# EAGLE design v1 (EAGLE 6.6.0)
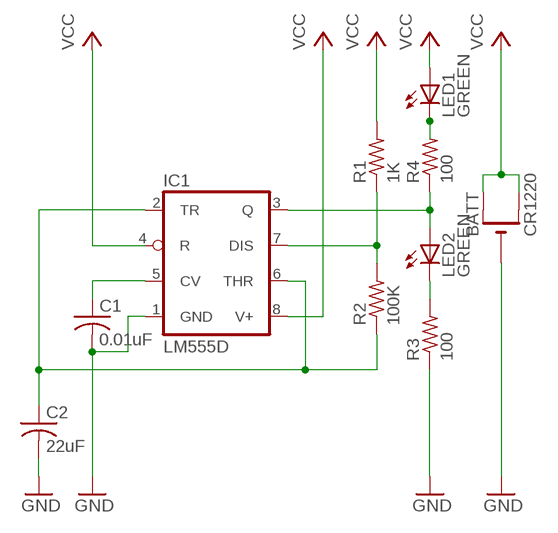
[diagram p0: schematic, sheet 1]

## Parts
BATT  CR1220  CR1220SMT  [CR1220-SMD]
C1  0.01uF  C-USC0805  [C0805]
C2  22uF  C-USC0805  [C0805]
IC1  LM555D  [SO08]
LED1  GREEN  LEDCHIP-LED0805  [CHIP-LED0805]
LED2  GREEN  LEDCHIP-LED0805  [CHIP-LED0805]
R1  1K  R-US_R0805  [R0805]
R2  100K  R-US_R0805  [R0805]
R3  100  R-US_R0805  [R0805]
R4  100  R-US_R0805  [R0805]

## Nets
GND: BATT.- C1.2 C2.2 IC1.1(GND) R3.1
N$1: LED1.C R4.2
N$2: IC1.3(Q) LED2.A R4.1
N$3: LED2.C R3.2
N$5: IC1.7(DIS) R1.1 R2.2
N$6: C2.1 IC1.2(TR) IC1.6(THR) R2.1
N$7: C1.1 IC1.5(CV)
VCC: BATT.+$1(+) BATT.+$2(+1) IC1.4(R) IC1.8(V+) LED1.A R1.2

## Library data of the parts
BATT = adafruit:CR1220: CR1216/CR1220/CR1225 12mm 3V lithium coin cell Great for battery packup. Both SMT and THM holders. Note the THM package has the ground pads on both sides of the PCB so that the masks are the same - this reduces the cost; OC_NEWARK: unknown
C1 = adafruit:C-US: CAPACITOR, American symbol; MF: AVX CORPORATION; MPN: 08051C103KAT2A; OC_NEWARK: 01H7150
C2 = adafruit:C-US: CAPACITOR, American symbol; MPN: C2012X5R1A226K125AB; OC_NEWARK: 04X3270
IC1 = adafruit:*555: TIMER Changed DIP package to have round (not oval) pin pads http://www.ladyada.net/library/pcb/eaglelibrary.html; MF: FAIRCHILD SEMICONDUCTOR; MPN: LM555CM; OC_NEWARK: 78K6011
LED1 LED2 = adafruit:LED: LED OSRAM: - CHIPLED LG R971, LG N971, LY N971, LG Q971, LY Q971, LO R971, LY R971 LH N974, LH R974 LS Q976, LO Q976, LY Q976 LO Q996 - Hyper CHIPLED LW Q18S LB Q993, LB Q99A, LB R99A - SideLED LS A670, LO A670, LY A670, LG A670, LP A670 LB A673, LV A673, LT A673, LW A673 LH A674 LY A675 LS A676, LA A676, LO A676, LY A676, LW A676 LS A679, LY A679, LG A679 - Hyper Micro SIDELED® LS Y876, LA Y876, LO Y876, LY Y876 LT Y87S - SmartLED LW L88C, LW L88S LB L89C, LB L89S, LG L890 LS L89K, LO L89K, LY L89K LS L896, LA L896, LO L896, LY L896 - TOPLED LS T670, LO T670, LY T670, LG T670, LP T670 LSG T670, LSP T670, LSY T670, LOP T670, LYG T670 LG T671, LOG T671, LSG T671 LB T673, LV T673, LT T673, LW T673 LH T674 LS T676, LA T676, LO T676, LY T676, LB T676, LH T676, LSB T676, LW T676 LB T67C, LV T67C, LT T67C, LS T67K, LO T67K, LY T67K, LW E67C LS E67B, LA E67B, LO E67B, LY E67B, LB E67C, LV E67C, LT E67C LW T67C LS T679, LY T679, LG T679 LS T770, LO T770, LY T770, LG T770, LP T770 LB T773, LV T773, LT T773, LW T773 LH T774 LS E675, LA E675, LY E675, LS T675 LS T776, LA T776, LO T776, LY T776, LB T776 LHGB T686 LT T68C, LB T68C - Hyper Mini TOPLED® LB M676 - Mini TOPLED Santana® LG M470 LS M47K, LO M47K, LY M47K Source: http://www.osram.convergy.de/; MPN: 150080VS75000; OC_NEWARK: 95W3803
R1 = adafruit:R-US_: RESISTOR, American symbol; MPN: ERA-6APB102P; OC_NEWARK: 15R1230
R2 = adafruit:R-US_: RESISTOR, American symbol; MF: VISHAY/DALE; MPN: CRCW0805100KFKTA; OC_NEWARK: 05F1513
R3 R4 = adafruit:R-US_: RESISTOR, American symbol; MF: VISHAY/DALE; MPN: CRCW0805100RJNEA; OC_NEWARK: 01H7765

## Net classes
0 default: width 0.305 mm, drill 0.508 mm, clearance 0.254 mm

## Board
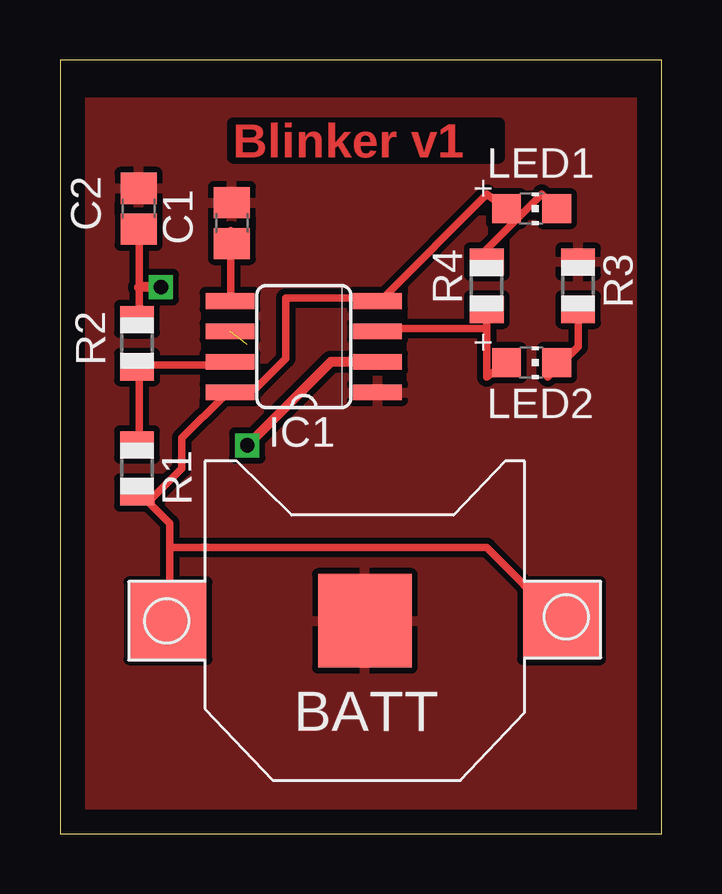
[diagram p1: board, top side]
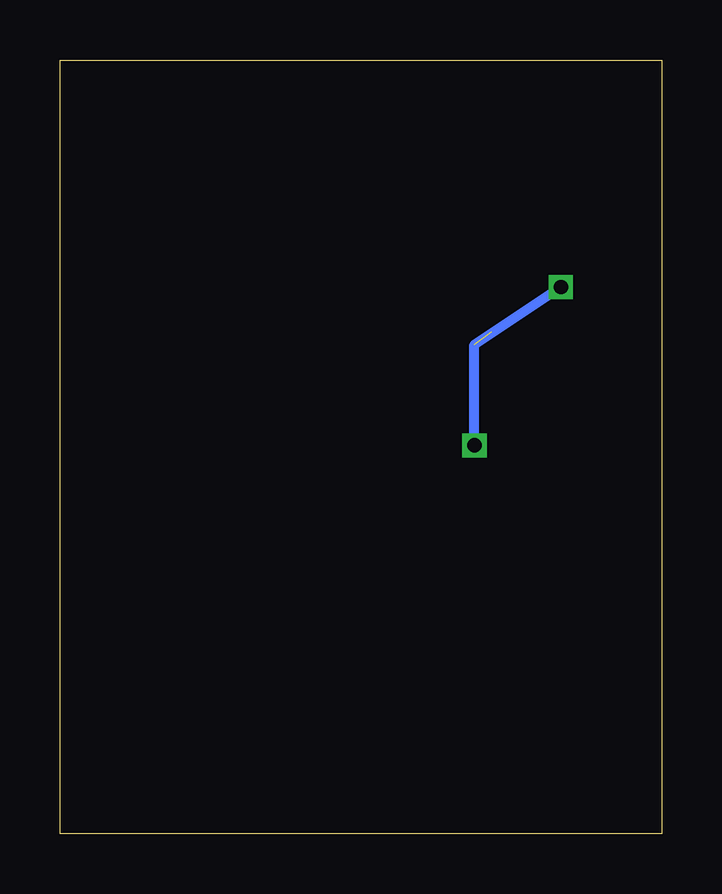
[diagram p2: board, bottom side, seen from below]

Size 25.07 x 32.27 mm. Coordinates in mm from the lower left corner, seen from the top.
Outline: 0,0 25.07,0 25.07,32.27 0,32.27 0,0
Copper layers (1*16): Top 0.035mm / dielectric 1.5mm / Bottom 0.035mm
Design rules "default": minimum track width 10mil, minimum drill 24mil, track to track 8mil, track to pad 8mil, pad to pad 8mil, via to via 8mil, smd to smd 8mil, copper to edge 40mil, drill to drill 8mil, minimum pad ring 10mil, minimum via ring 8mil, stop-mask expansion 4mil, vias tented up to drill 0mil, thermal gap 10mil

### Footprints (pad centres in the part's own frame; a part is rotated, then mirrored left to right if it is on the bottom)
CR1220-SMD = smd 3.2 x 3.2: +$1 -8.2,0; +$2 8.2,0 | smd 3.9 x 3.9: - 0,0
C0805 = smd 1.3 x 1.5: 1 -0.85,0; 2 0.85,0
SO08 = smd 0.66 x 2.032: 1 -1.905,-3.073; 2 -0.635,-3.073; 3 0.635,-3.073; 4 1.905,-3.073; 5 1.905,3.073; 6 0.635,3.073; 7 -0.635,3.073; 8 -1.905,3.073
CHIP-LED0805 = smd 1.2 x 1.2: A 0,-1.05; C 0,1.05
R0805 = smd 1.1 x 1.4: 1 -1,0; 2 1,0

### Placement (x,y rotation side)
BATT  12.7,8.89 0 top
C1  7.16,25.47 90 top
C2  3.28,26.07 90 top
IC1  10.16,20.32 90 top
LED1  19.65,26.07 270 top
LED2  19.65,19.65 270 top
R1  3.21,15.24 270 top
R2  3.21,20.46 270 top
R3  21.59,22.86 270 top
R4  17.78,22.86 90 top

### Tracks (layer width: path | path; a pad name or v marks a point on that pad's centre or on a via)
GND
  pour Top: 0,30.48 0,0 25.4,0 25.4,30.48
N$1
  Top 0.305: R4.2 17.78,24.38 20.07,26.67 LED1.C
N$2
  Top 0.305: R4.1 17.78,21.08 | 17.78,21.08 17.78,19.05 LED2.A | 17.78,21.08 13.46,21.08 IC1.3
N$3
  Top 0.305: R3.2 21.59,20.32 20.32,19.05 LED2.C
N$5
  Top 0.305: R1.1 3.3,16.26 3.3,19.3 R2.2 3.3,19.56 6.86,19.56 IC1.7
N$6  (via drill 0.6)  (1 unrouted)
  Top 0.305: R2.1 3.3,21.59 3.3,22.8 3.3,25.15 C2.1
  Top 0.406: IC1.2 11.29,19.68 v7.8,16.2 | v4.2,22.8 3.3,22.8
  Bottom 0.406: v7.8,16.2 7.8,20.4 v4.2,22.8
N$7
  Top 0.305: C1.1 7.11,25.15 7.11,22.35 IC1.5
VCC
  Top 0.305: LED1.A 17.78,26.67 13.46,22.35 IC1.4 13.21,22.35 9.4,22.35 9.4,19.81 8.13,18.54 7.11,18.54 IC1.8 6.86,18.29 5.08,16.51 5.08,15.24 3.81,13.97 3.81,13.72 | 3.81,13.72 4.57,12.95 4.57,11.94 | 3.81,13.72 3.3,14.22 R1.2 3.81,13.72 | 4.57,11.94 4.57,8.89 BATT.+$1 | 4.57,11.94 17.78,11.94 20.83,8.89 BATT.+$2

### Text on the board
Top: Blinker v1